# EAGLE design NoTricks (EAGLE 7.6.0)
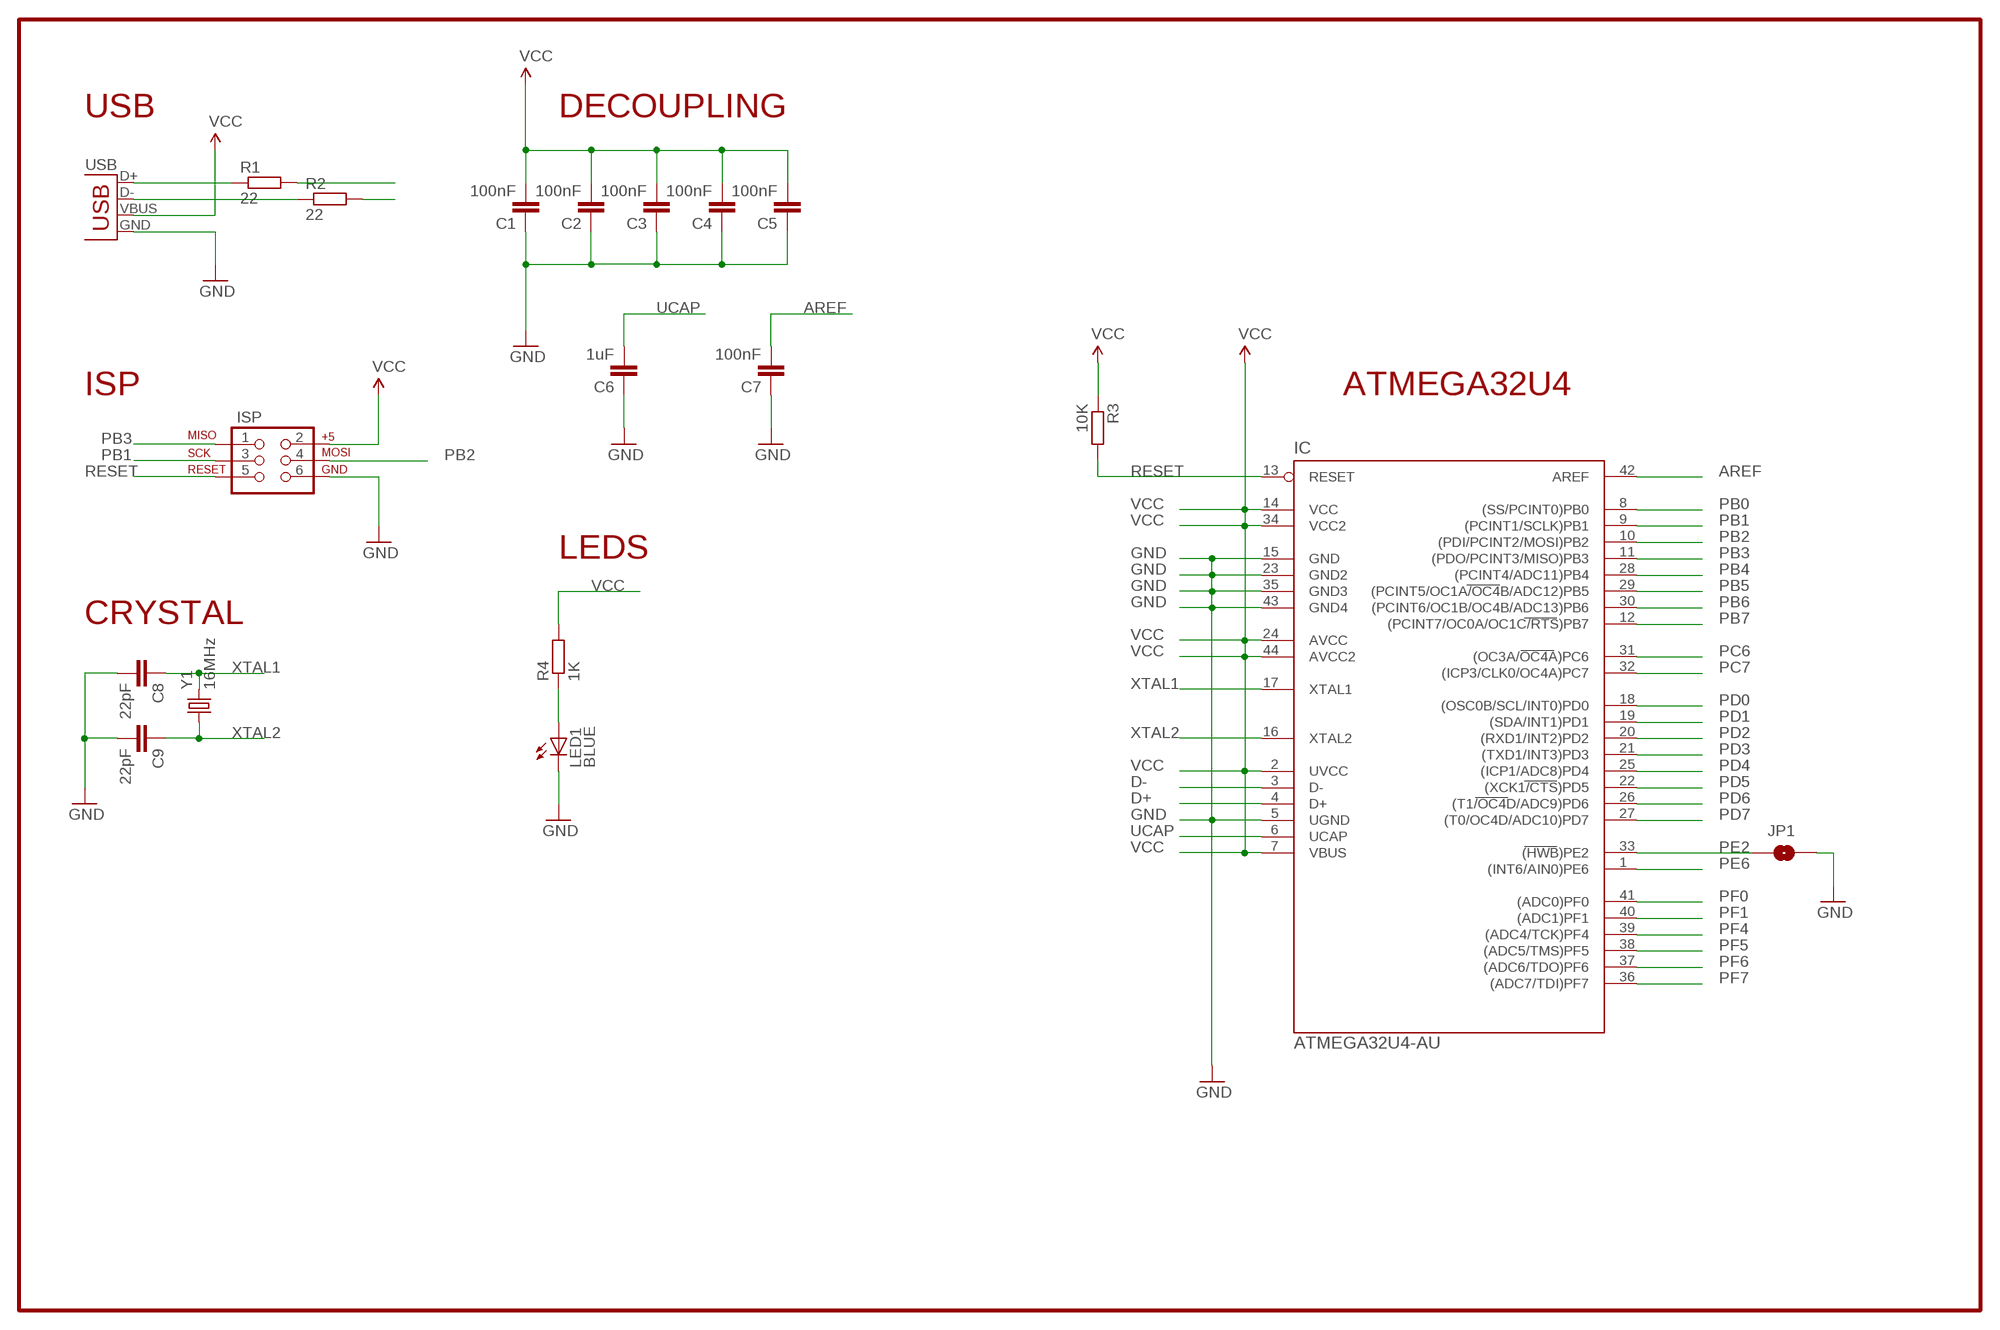
[diagram p0: schematic, sheet 1]

## Parts
C1  100nF  C-EUC0805  [C0805]
C2  100nF  C-EUC0805  [C0805]
C3  100nF  C-EUC0805  [C0805]
C4  100nF  C-EUC0805  [C0805]
C5  100nF  C-EUC0805  [C0805]
C6  1uF  C-EUC0805  [C0805]
C7  100nF  C-EUC0805  [C0805]
C8  22pF  C-EUC0805  [C0805]
C9  22pF  C-EUC0805  [C0805]
IC  ATMEGA32U4-AU  [TQFP44]
ISP  AVR_SPI_PRG_6PTH  [2X3]
JP1  JUMPER-PAD-2-NO  [PAD-JUMPER-2-NO_NO_SILK]
LED1  BLUE  LED1206  [LED-1206]
R1  22  R-EU_R0603  [R0603]
R2  22  R-EU_R0603  [R0603]
R3  10K  R-EU_R0603  [R0603]
R4  1K  R-EU_R0603  [R0603]
USB  USB-A-H  [USB-A-H]
Y1  16MHz  CRYSTALCRYSTAL-SMD-5X3-12MHZ  [CRYSTAL-SMD-5X3]

## Nets
AREF: C7.2 IC.42(AREF)
D+: IC.4(D+) R1.2
D-: IC.3(D-) R2.2
GND: C1.1 C2.1 C3.1 C4.1 C5.1 C6.1 C7.1 C8.2 C9.2 IC.5(UGND) IC.15(GND) IC.23(GND2) IC.35(GND3) IC.43(GND4) ISP.6 JP1.2 LED1.C USB.GND
N$1: R1.1 USB.D+
N$2: LED1.A R4.1
N$3: R2.1 USB.D-
PB0: IC.8((SS/PCINT0)PB0)
PB1: IC.9((PCINT1/SCLK)PB1) ISP.3
PB2: IC.10((PDI/PCINT2/MOSI)PB2) ISP.4
PB3: IC.11((PDO/PCINT3/MISO)PB3) ISP.1
PB4: IC.28((PCINT4/ADC11)PB4)
PB5: IC.29((PCINT5/OC1A/OC4B/ADC12)PB5)
PB6: IC.30((PCINT6/OC1B/OC4B/ADC13)PB6)
PB7: IC.12((PCINT7/OC0A/OC1C/RTS)PB7)
PC6: IC.31((OC3A/OC4A)PC6)
PC7: IC.32((ICP3/CLK0/OC4A)PC7)
PD0: IC.18((OSC0B/SCL/INT0)PD0)
PD1: IC.19((SDA/INT1)PD1)
PD2: IC.20((RXD1/INT2)PD2)
PD3: IC.21((TXD1/INT3)PD3)
PD4: IC.25((ICP1/ADC8)PD4)
PD5: IC.22((XCK1/CTS)PD5)
PD6: IC.26((T1/OC4D/ADC9)PD6)
PD7: IC.27((T0/OC4D/ADC10)PD7)
PE2: IC.33((HWB)PE2) JP1.1
PE6: IC.1((INT6/AIN0)PE6)
PF0: IC.41((ADC0)PF0)
PF1: IC.40((ADC1)PF1)
PF4: IC.39((ADC4/TCK)PF4)
PF5: IC.38((ADC5/TMS)PF5)
PF6: IC.37((ADC6/TDO)PF6)
PF7: IC.36((ADC7/TDI)PF7)
RESET: IC.13(RESET) ISP.5 R3.2
UCAP: C6.2 IC.6(UCAP)
VCC: C1.2 C2.2 C3.2 C4.2 C5.2 IC.2(UVCC) IC.7(VBUS) IC.14(VCC) IC.24(AVCC) IC.34(VCC2) IC.44(AVCC2) ISP.2 R3.1 R4.2 USB.VBUS
XTAL1: C8.1 IC.17(XTAL1) Y1.3
XTAL2: C9.1 IC.16(XTAL2) Y1.1

## Notes on the sheet
- USB | DECOUPLING
- ISP | ATMEGA32U4
- LEDS
- CRYSTAL

## Library data of the parts
C1-C9 = resistor:C-EU: CAPACITOR, European symbol
IC = mega32U4:ATMEGA32U4-AU
ISP = SparkFun-Connectors:AVR_SPI_PRG_6: AVR ISP 6 Pin This is the reduced ISP connector for AVR programming. Common on Arduino. This footprint will take up less PCB space and can be used with a 10-pin to 6-pin adapter such as SKU: BOB-08508 **Special note about "TEST_POINT" package. The stop mask is on the top side, so if you want your programming test points to be on the bottom of your board, make sure to place this package on the bottom side of the board. This also ensure that the orientation to program from the bottom side will be correct.
JP1 = SparkFun-Passives:JUMPER-PAD-2-NO
LED1 = LilyPad-Wearables:LED: LEDs Standard schematic elements and footprints for 5mm, 3mm, 1206, and 0603 sized LEDs. 5mm - Spark Fun Electronics SKU : Comp-SBL
R1-R4 = resistor:R-EU_: RESISTOR, European symbol
USB = SparkFun-Connectors:USB: USB Connectors USB-B-PTH is fully proven SKU : PRT-00139/CONN-08278 USB-miniB is fully proven SKU : PRT-00587 USB-A-PCB is untested. USB-A-H is throughly reviewed, but untested. Spark Fun Electronics SKU : PRT-00437 USB-B-SMT is throughly reviewed, but untested. Needs silkscreen touching up. USB-A-S has not been used/tested USB-MB-H has not been used/tested USB-MICROB has been used. CONN-09505; PROD_ID: CONN-08367
Y1 = SparkFun-FreqCtrl:CRYSTAL: Various standard crystals. Proven footprints.; PROD_ID: XTAL-08297; VALUE: 12MHz

## Board
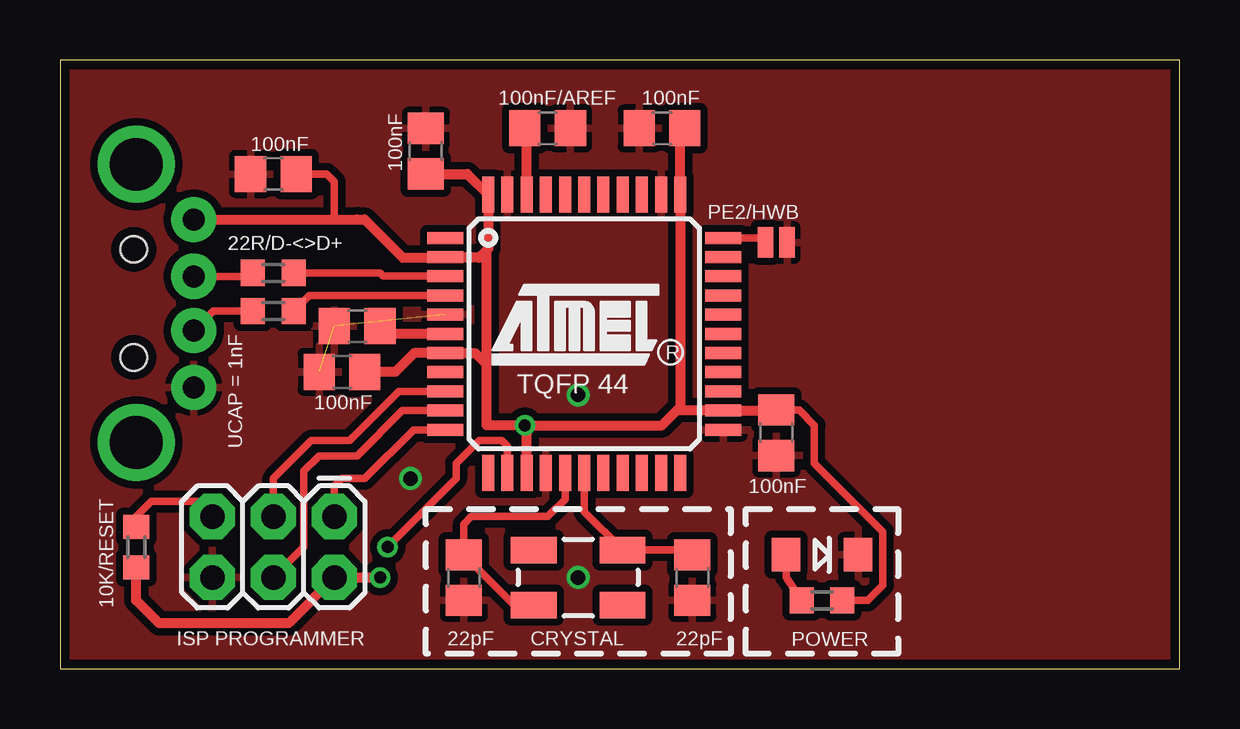
[diagram p1: board, top side]
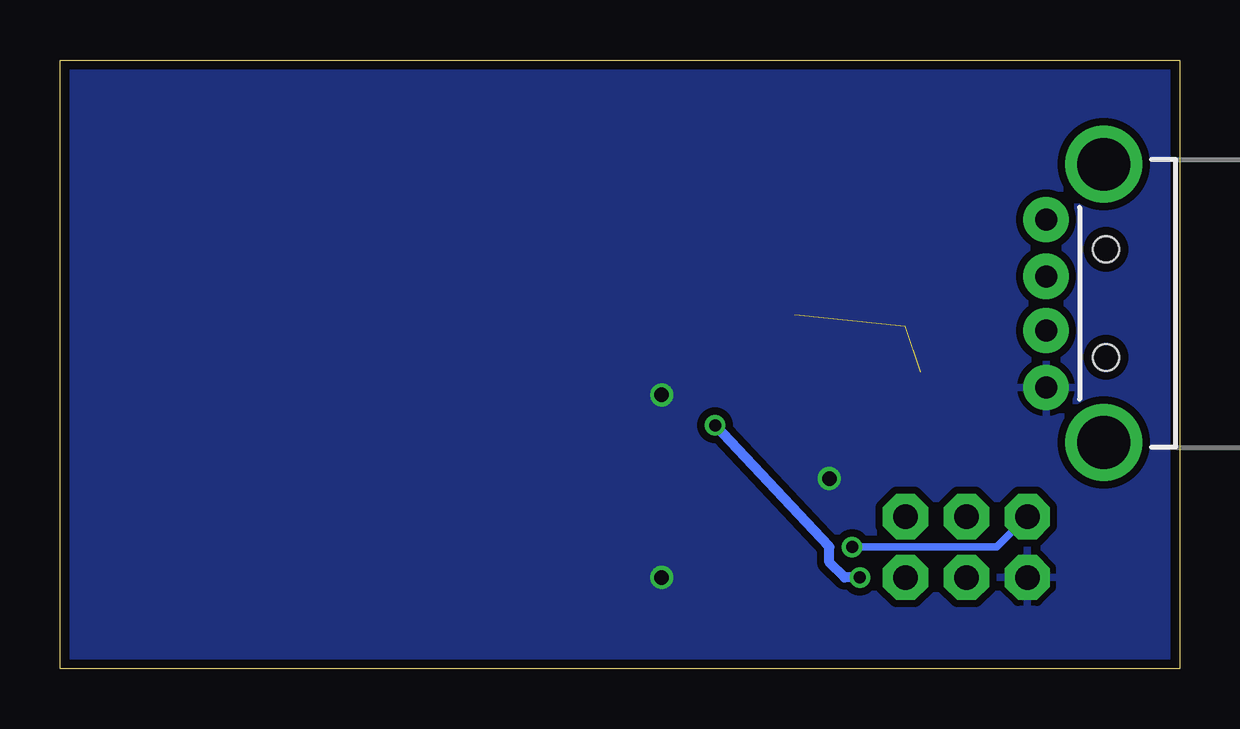
[diagram p2: board, bottom side, seen from below]

Size 46.66 x 25.39 mm. Coordinates in mm from the lower left corner, seen from the top.
Outline: 0,0 46.66,0 46.66,25.39 0,25.39 0,0
Copper layers (1*16): Top 0.0356mm / dielectric 1.5011mm / Bottom 0.0356mm
Design rules "oshpark-2layer": minimum track width 6mil, minimum drill 13mil, track to track 6mil, track to pad 6mil, pad to pad 6mil, via to via 6mil, smd to smd 6mil, copper to edge 15mil, drill to drill 6mil, minimum pad ring 7mil, minimum via ring 7mil, stop-mask expansion 2.5mil, vias tented up to drill 0mil, thermal gap 10mil

### Footprints (pad centres in the part's own frame; a part is rotated, then mirrored left to right if it is on the bottom)
C0805 = smd 1.3 x 1.5: 1 -0.95,0; 2 0.95,0
TQFP44 = smd 1.5 x 0.5: 1 -5.8,4; 2 -5.8,3.2; 3 -5.8,2.4; 4 -5.8,1.6; 5 -5.8,0.8; 6 -5.8,0; 7 -5.8,-0.8; 8 -5.8,-1.6; 9 -5.8,-2.4; 10 -5.8,-3.2; 11 -5.8,-4; 23 5.8,-4; 24 5.8,-3.2; 25 5.8,-2.4; 26 5.8,-1.6; 27 5.8,-0.8; 28 5.8,0; 29 5.8,0.8; 30 5.8,1.6; 31 5.8,2.4; 32 5.8,3.2; 33 5.8,4 | smd 0.5 x 1.5: 12 -4,-5.8; 13 -3.2,-5.8; 14 -2.4,-5.8; 15 -1.6,-5.8; 16 -0.8,-5.8; 17 0,-5.8; 18 0.8,-5.8; 19 1.6,-5.8; 20 2.4,-5.8; 21 3.2,-5.8; 22 4,-5.8; 34 4,5.8; 35 3.2,5.8; 36 2.4,5.8; 37 1.6,5.8; 38 0.8,5.8; 39 0,5.8; 40 -0.8,5.8; 41 -1.6,5.8; 42 -2.4,5.8; 43 -3.2,5.8; 44 -4,5.8
2X3 = drill 1.016 pad 1.88 octagon: 1 0,0; 2 0,2.54; 3 2.54,0; 4 2.54,2.54; 5 5.08,0; 6 5.08,2.54
PAD-JUMPER-2-NO_NO_SILK = smd 0.635 x 1.27: 1 -0.45,0; 2 0.45,0
LED-1206 = smd 1.2 x 1.4: A -1.5,0; C 1.5,0
R0603 = smd 1 x 1.1: 1 -0.85,0; 2 0.85,0
USB-A-H = drill 0.914 pad 1.88: D+ 2.4,1.127; D- 2.4,-1.127; GND 2.4,3.5; VBUS 2.4,-3.5 | drill 2.2: GND2 0,-5.8; GND3 0,5.8 | hole 1.1: -0.1,2.25; -0.1,-2.25
CRYSTAL-SMD-5X3 = smd 1.9 x 1.1: 1 -1.85,-1.15; 2 1.85,-1.15; 3 1.85,1.15; 4 -1.85,1.15

### Placement (x,y rotation side)
C1  29.84,9.84 90 top
C2  25.08,22.54 0 top
C3  8.89,20.64 0 top
C4  15.24,21.59 270 top
C5  11.75,12.38 0 top
C6  12.38,14.29 0 top
C7  20.32,22.54 180 top
C8  26.35,3.81 270 top
C9  16.83,3.81 270 top
IC  21.84,13.97 0 top
ISP  11.43,6.35 180 top
JP1  29.84,17.78 0 top
LED1  31.75,4.76 0 top
R1  8.89,14.92 0 top
R2  8.89,16.51 0 top
R3  3.17,5.08 90 top
R4  31.75,2.86 0 top
USB  3.17,15.24 180 bottom
Y1  21.59,3.81 0 top

### Tracks (layer width: path | path; a pad name or v marks a point on that pad's centre or on a via)
AREF
  Top 0.406: IC.42 19.44,22.47 C7.2
D+
  Top 0.305: R1.2 10.39,15.57 IC.4
D-
  Top 0.305: IC.3 13.47,16.37 13.34,16.51 R2.2
GND  (via drill 0.6)  (2 unrouted)
  other vias: 21.59,3.81 21.59,11.43 14.61,7.94
  pour Top (isolate 0.305): -1.27,26.67 48.26,26.67 48.26,-1.27 -1.27,-1.27
  pour Bottom (isolate 0.305): -3.81,29.21 50.8,29.21 50.8,-3.81 -3.81,-3.81
N$1
  Top 0.305: USB.D+ 6.38,14.92 R1.1
N$2
  Top 0.305: LED1.A 30.25,3.83 R4.1
N$3
  Top 0.305: R2.1 7.9,16.37 USB.D-
PB1
  Top 0.305: IC.9 14.11,11.57 12.06,9.53 10.48,9.53 8.89,7.94 ISP.3
PB2
  Top 0.305: IC.10 14.26,10.77 12.38,8.89 10.79,8.89 10.16,8.26 10.16,5.08 ISP.4
PB3
  Top 0.305: ISP.1 11.43,7.62 11.75,7.94 12.7,7.94 14.73,9.97 IC.11
PE2
  Top 0.305: IC.33 29.2,17.97 JP1.1
RESET  (via drill 0.5)
  Top 0.305: IC.13 18.64,9.3 18.41,9.53 17.46,9.53 16.51,8.57 16.51,7.94 v13.65,5.08 | R3.2 3.17,6.35 3.81,6.99 5.71,6.99 ISP.5
  Bottom 0.305: ISP.5 7.62,5.08 v13.65,5.08
UCAP
  Top 0.406: IC.6 13.65,13.97 C6.2
VCC  (via drill 0.5)
  Top 0.305: C3.2 11.11,20.64 11.43,20.32 11.43,18.74 | R4.2 33.66,2.86 34.29,3.49 34.29,5.71 31.43,8.57 31.43,10.16 30.8,10.79 C1.2
  Top 0.406: USB.VBUS 11.43,18.74 12.69,18.74 | 12.69,18.74 14.29,17.14 16.02,17.14 IC.2 16.07,17.14 17.46,17.14 17.78,17.46 | v13.34,3.81 ISP.2 9.53,1.91 4.13,1.91 3.17,2.86 R3.1 | v19.37,10.16 25.08,10.16 25.72,10.79 | 25.72,10.79 27.62,10.79 IC.24 29.82,10.77 C1.2 | 25.72,10.79 25.84,10.92 IC.34 25.84,22.35 C2.2 | v19.37,10.16 17.78,10.16 17.78,12.7 | 17.78,12.7 17.78,17.46 | 17.78,17.46 17.84,17.53 IC.44 16.97,20.64 C4.2 | 12.38,18.75 12.69,18.74 | IC.14 19.44,10.08 v19.37,10.16 | 17.78,12.7 17.31,13.17 IC.7 14.76,13.17 13.97,12.38 C5.2
  Bottom 0.406: v13.34,3.81 13.97,3.81 14.61,4.45 14.61,5.08 v19.37,10.16
XTAL1
  Top 0.305: IC.17 21.84,6.56 Y1.3 26.15,4.96 C8.1
XTAL2
  Top 0.305: IC.16 21.04,7.07 20.32,6.35 17.14,6.35 16.83,6.03 C9.1 18.93,2.66 Y1.1

### Text on the board
tPlace: 100nF/AREF | 100nF | 100nF | 100nF | PE2/HWB | 22R/D-<>D+ | UCAP = 1nF | 100nF | 100nF | 10K/RESET | ISP PROGRAMMER | 22pF | CRYSTAL | 22pF | POWER